# EAGLE design SNES2USB (EAGLE 9.5.2)
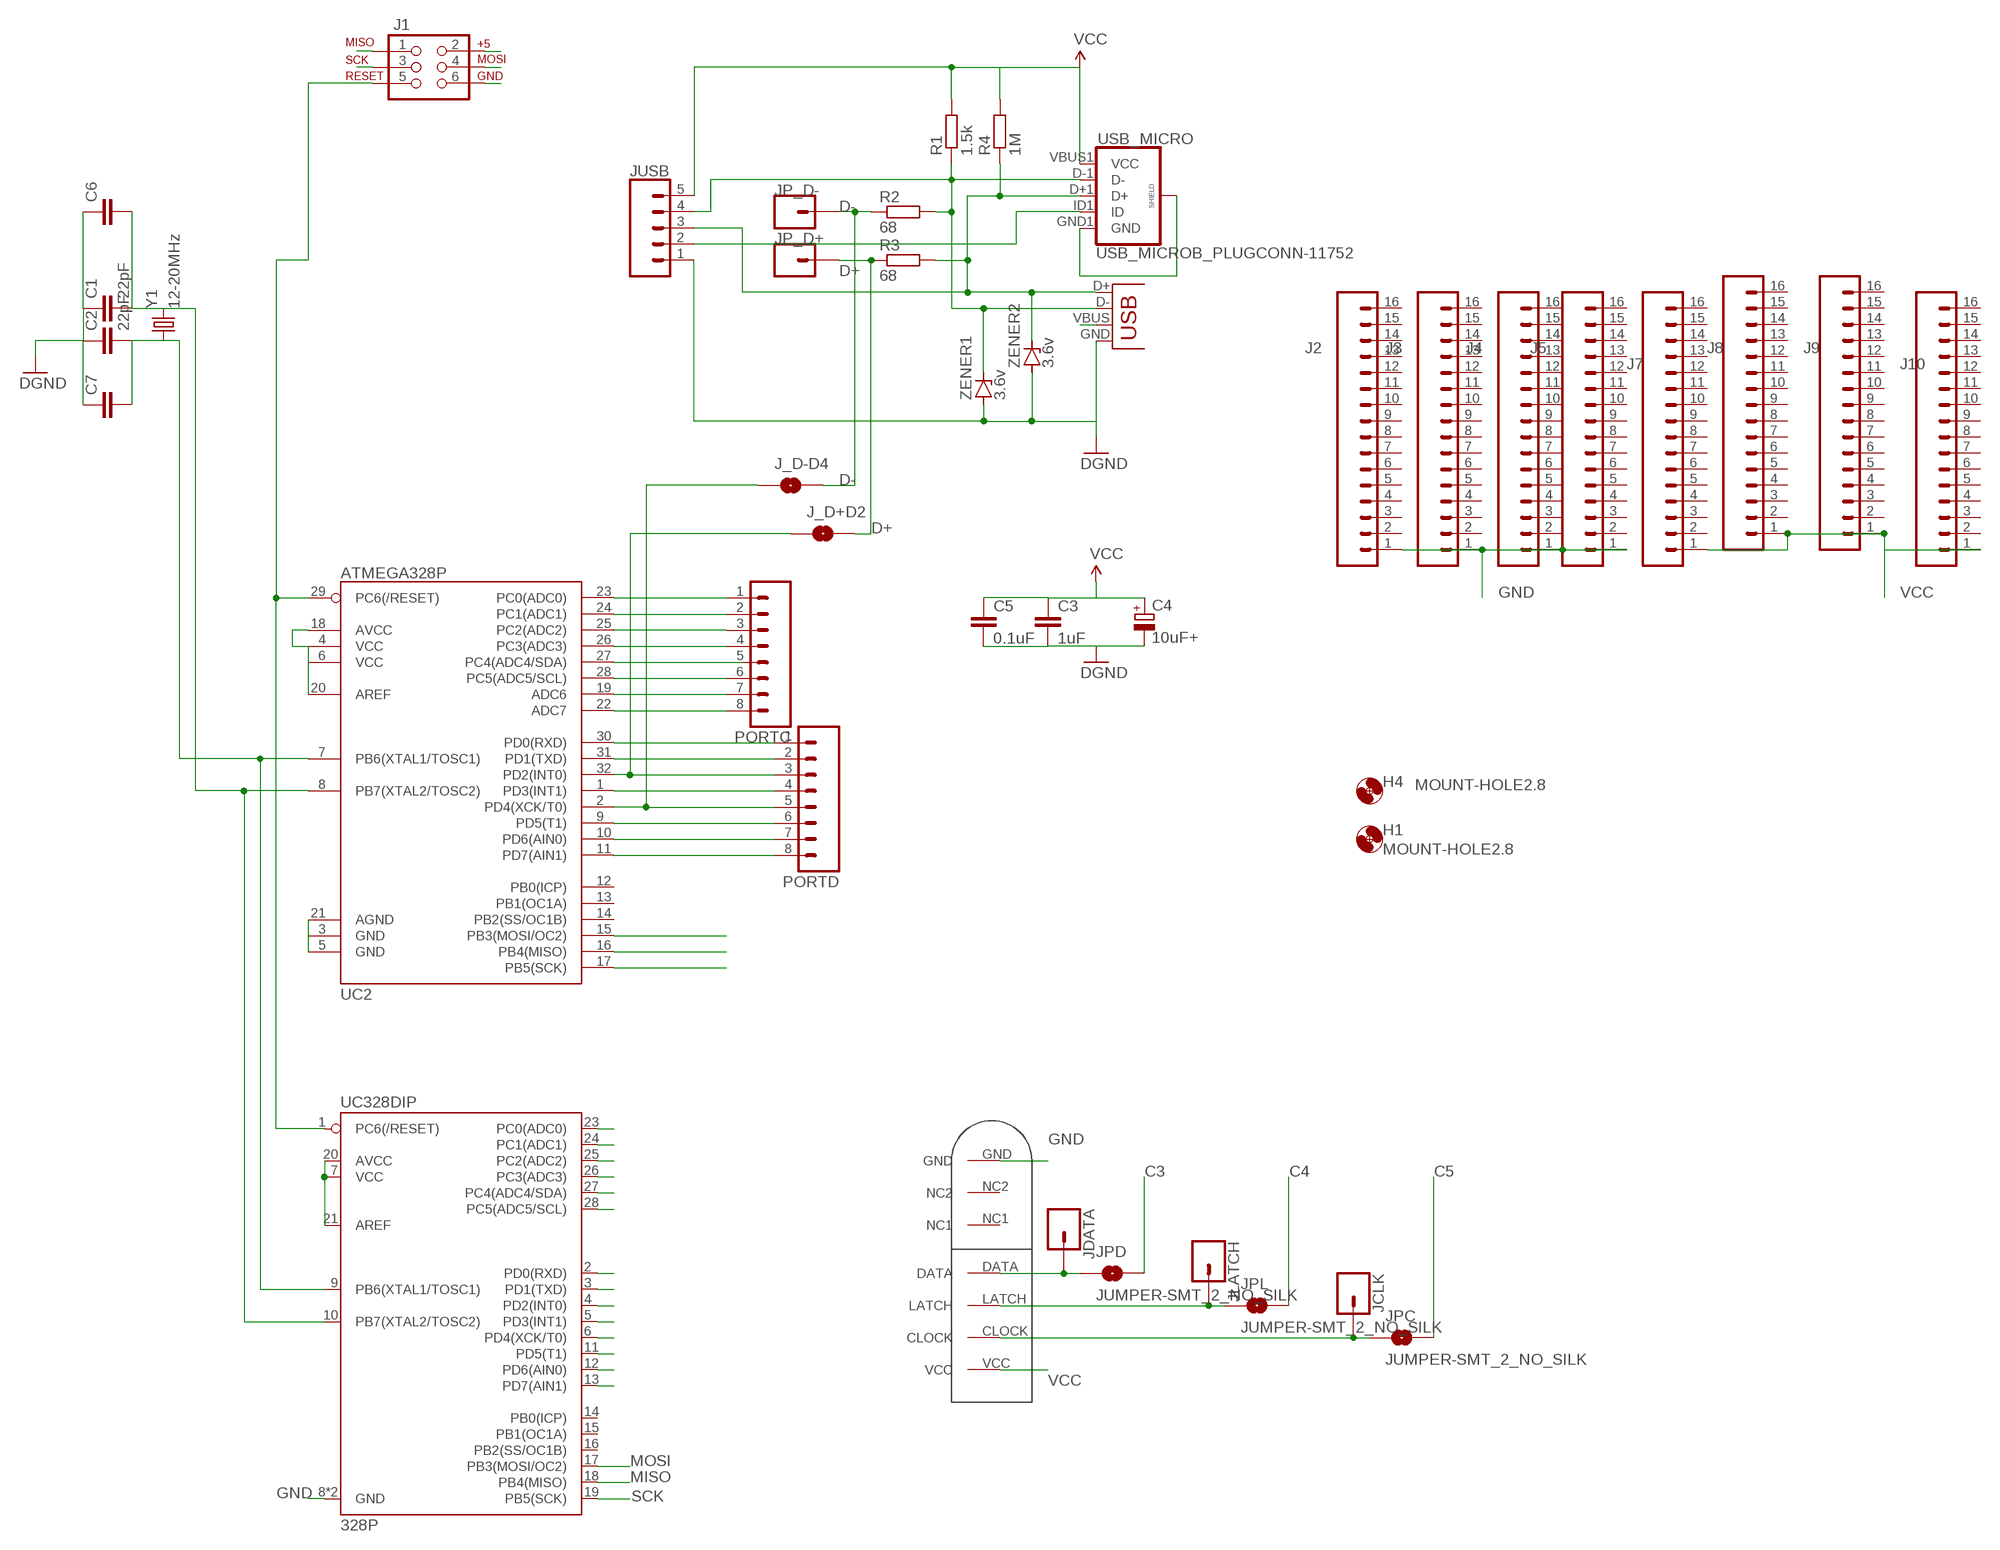
[diagram p0: schematic, sheet 1]

## Parts
C1  22pF  C-EU025-024X044  [C025-024X044]
C2  22pF  C-EU025-024X044  [C025-024X044]
C3  1uF  C-EU025-024X044  [C025-024X044]
C4  10uF+  CPOL-EUE2-5  [E2-5]
C5  0.1uF  C-EU025-024X044  [C025-024X044]
C6  C-EUC1206K  [C1206K]
C7  C-EUC1206K  [C1206K]
H1  MOUNT-HOLE2.8  [2,8]
H4  MOUNT-HOLE2.8  [2,8]
J1  AVR_SPI_PRG_6PTH  [2X3]
J2  CONN_161X16_NO_SILK  [1X16_NO_SILK]
J3  CONN_161X16_NO_SILK  [1X16_NO_SILK]
J4  CONN_161X16_NO_SILK  [1X16_NO_SILK]
J5  CONN_161X16_NO_SILK  [1X16_NO_SILK]
J7  CONN_161X16_NO_SILK  [1X16_NO_SILK]
J8  CONN_161X16_NO_SILK  [1X16_NO_SILK]
J9  CONN_161X16_NO_SILK  [1X16_NO_SILK]
J10  CONN_161X16_NO_SILK  [1X16_NO_SILK]
J_D+D2  JUMPER-PAD-2-NOYES_SILK  [PAD-JUMPER-2-NO_YES_SILK]
J_D-D4  JUMPER-PAD-2-NOYES_SILK  [PAD-JUMPER-2-NO_YES_SILK]
JCLK  CONN_01PTH_NO_SILK_YES_STOP  [1X01_NO_SILK]
JDATA  CONN_01PTH_NO_SILK_YES_STOP  [1X01_NO_SILK]
JLATCH  CONN_01PTH_NO_SILK_YES_STOP  [1X01_NO_SILK]
JP_D+  CONN_01PTH_NO_SILK_YES_STOP  [1X01_NO_SILK]
JP_D-  CONN_01PTH_NO_SILK_YES_STOP  [1X01_NO_SILK]
JPC  JUMPER-SMT_2_NO_SILK  [SMT-JUMPER_2_NO_SILK]
JPD  JUMPER-SMT_2_NO_SILK  [SMT-JUMPER_2_NO_SILK]
JPL  JUMPER-SMT_2_NO_SILK  [SMT-JUMPER_2_NO_SILK]
JUSB  CONN_05  [1X05]
PORTC  M081X08  [1X08]
PORTD  M081X08  [1X08]
R1  1.5k  R-EU_0204/2V  [0204V]
R2  68  R-EU_0204/2V  [0204V]
R3  68  R-EU_0204/2V  [0204V]
R4  1M  R-EU_0204/2V  [0204V]
U$1  SNES_JOYPAD_CONNECTOR  [SNES_PAD]
UC2  ATMEGA328P  ATMEGA328_SMT  [TQFP32-08]
UC328DIP  328P  ATMEGA328P_PDIP  [DIP28]
USB_MICRO  USB_MICROB_PLUGCONN-11752  [USB-B-MICRO-SMD_V03]
USB_MINI  USBSMD  [USB-MINIB]
Y1  12-20MHz  CRYSTALHC49UV  [HC49U-V]
ZENER1  3.6v  ZENER-DIODEZD-2.5  [ZDIO-2.5]
ZENER2  3.6v  ZENER-DIODEZD-2.5  [ZDIO-2.5]

## Nets
B6: C2.2 C7.2 UC2.7(PB6(XTAL1/TOSC1)) UC328DIP.9(PB6(XTAL1/TOSC1)) Y1.1
B7: C1.2 C6.2 UC2.8(PB7(XTAL2/TOSC2)) UC328DIP.10(PB7(XTAL2/TOSC2)) Y1.2
C0: PORTC.1 UC2.23(PC0(ADC0)) UC328DIP.23(PC0(ADC0))
C1: PORTC.2 UC2.24(PC1(ADC1)) UC328DIP.24(PC1(ADC1))
C2: UC328DIP.25(PC2(ADC2))
C3: JPD.2 PORTC.4 UC2.26(PC3(ADC3)) UC328DIP.26(PC3(ADC3))
C4: JPL.2 PORTC.5 UC2.27(PC4(ADC4/SDA)) UC328DIP.27(PC4(ADC4/SDA))
C5: JPC.2 PORTC.6 UC2.28(PC5(ADC5/SCL)) UC328DIP.28(PC5(ADC5/SCL))
D0: PORTD.1 UC2.30(PD0(RXD)) UC328DIP.2(PD0(RXD))
D1: PORTD.2 UC2.31(PD1(TXD)) UC328DIP.3(PD1(TXD))
D2: J_D+D2.1 PORTD.3 UC2.32(PD2(INT0)) UC328DIP.4(PD2(INT0))
D3: PORTD.4 UC2.1(PD3(INT1)) UC328DIP.5(PD3(INT1))
D4: J_D-D4.1 PORTD.5 UC2.2(PD4(XCK/T0)) UC328DIP.6(PD4(XCK/T0))
D5: PORTD.6 UC2.9(PD5(T1)) UC328DIP.11(PD5(T1))
D6: PORTD.7 UC2.10(PD6(AIN0)) UC328DIP.12(PD6(AIN0))
D7: PORTD.8 UC2.11(PD7(AIN1)) UC328DIP.13(PD7(AIN1))
D+: J_D+D2.2 JP_D+.1 R3.1
D-: J_D-D4.2 JP_D-.1 R2.1
GND: C1.1 C2.1 C3.2 C4.- C5.2 C6.1 C7.1 J1.6 J2.1 J3.1 J4.1 J5.1 JUSB.1 U$1.GND UC2.3(GND) UC2.5(GND) UC2.21(AGND) UC328DIP.8(GND) UC328DIP.22(GND) USB_MICRO.GND1(GND) USB_MICRO.SHIELD1(SHIELD) USB_MICRO.SHIELD2(SHIELD) USB_MICRO.SHIELD3(SHIELD) USB_MINI.GND ZENER1.A ZENER2.A ; supply symbol labelled DGND
MISO: J1.1 UC2.16(PB4(MISO)) UC328DIP.18(PB4(MISO))
MOSI: J1.4 UC2.15(PB3(MOSI/OC2)) UC328DIP.17(PB3(MOSI/OC2))
N$1: JUSB.2 USB_MICRO.ID1(ID)
N$2: JDATA.1 JPD.1 U$1.DATA
N$3: PORTC.3 UC2.25(PC2(ADC2))
N$4: JLATCH.1 JPL.1 U$1.LATCH
N$5: JCLK.1 JPC.1 U$1.CLOCK
N$11: PORTC.7 UC2.19(ADC6)
N$12: PORTC.8 UC2.22(ADC7)
RESET: J1.5 UC2.29(PC6(/RESET)) UC328DIP.1(PC6(/RESET))
SCK: J1.3 UC2.17(PB5(SCK)) UC328DIP.19(PB5(SCK))
USBD+: JUSB.3 R3.2 R4.1 USB_MICRO.D+1(D+) USB_MINI.D+ ZENER2.C
USBD-: JUSB.4 R1.1 R2.2 USB_MICRO.D-1(D-) USB_MINI.D- ZENER1.C
VCC: C3.1 C4.+ C5.1 J1.2 J7.1 J8.1 J9.1 J10.1 JUSB.5 R1.2 R4.2 U$1.VCC UC2.4(VCC) UC2.6(VCC) UC2.18(AVCC) UC2.20(AREF) UC328DIP.7(VCC) UC328DIP.20(AVCC) UC328DIP.21(AREF) USB_MICRO.VBUS1(VCC) USB_MINI.VBUS
Unconnected: J2.2 J2.3 J2.4 J2.5 J2.6 J2.7 J2.8 J2.9 J2.10 J2.11 J2.12 J2.13 J2.14 J2.15 J2.16 J3.2 J3.3 J3.4 J3.5 J3.6 J3.7 J3.8 J3.9 J3.10 J3.11 J3.12 J3.13 J3.14 J3.15 J3.16 J4.2 J4.3 J4.4 J4.5 J4.6 J4.7 J4.8 J4.9 J4.10 J4.11 J4.12 J4.13 J4.14 J4.15 J4.16 J5.2 J5.3 J5.4 J5.5 J5.6 J5.7 J5.8 J5.9 J5.10 J5.11 J5.12 J5.13 J5.14 J5.15 J5.16 J7.2 J7.3 J7.4 J7.5 J7.6 J7.7 J7.8 J7.9 J7.10 J7.11 J7.12 J7.13 J7.14 J7.15 J7.16 J8.2 J8.3 J8.4 J8.5 J8.6 J8.7 J8.8 J8.9 J8.10 J8.11 J8.12 J8.13 J8.14 J8.15 J8.16 J9.2 J9.3 J9.4 J9.5 J9.6 J9.7 J9.8 J9.9 J9.10 J9.11 J9.12 J9.13 J9.14 J9.15 J9.16 J10.2 J10.3 J10.4 J10.5 J10.6 J10.7 J10.8 J10.9 J10.10 J10.11 J10.12 J10.13 J10.14 J10.15 J10.16 U$1.NC1 U$1.NC2 UC2.12(PB0(ICP)) UC2.13(PB1(OC1A)) UC2.14(PB2(SS/OC1B)) UC328DIP.14(PB0(ICP)) UC328DIP.15(PB1(OC1A)) UC328DIP.16(PB2(SS/OC1B))

## Library data of the parts
C1-C3 C5-C7 = resistor:C-EU: CAPACITOR, European symbol
C4 = resistor:CPOL-EU: POLARIZED CAPACITOR, European symbol
H1 H4 = holes:MOUNT-HOLE: MOUNTING HOLE with drill center marker
J1 = SparkFun-Connectors:AVR_SPI_PRG_6: AVR ISP 6 Pin This is the reduced ISP connector for AVR programming. Common on Arduino. This footprint will take up less PCB space and can be used with a 10-pin to 6-pin adapter such as SKU: BOB-08508 **Special note about "TEST_POINT" package. The stop mask is on the top side, so if you want your programming test points to be on the bottom of your board, make sure to place this package on the bottom side of the board. This also ensure that the orientation to program from the bottom side will be correct.
J2-J5 J7-J10 = SparkFun-Connectors:CONN_16: Multi connection point. Often used as Generic Header-pin footprint for 0.1 inch spaced/style header connections On any of the 0.1 inch spaced packages, you can populate with these: Break Away Headers - Straight <https://www.sparkfun.com/products/116> (PRT-00116) Break Away Male Headers - Right Angle <https://www.sparkfun.com/products/553> (PRT-00553) Female Headers <https://www.sparkfun.com/products/115> (PRT-00115) Break Away Headers - Machine Pin <https://www.sparkfun.com/products/117> (PRT-00117) Break Away Female Headers - Swiss Machine Pin <https://www.sparkfun.com/products/743> (PRT-00743) For SCREWTERMINALS and SPRING TERMINALS visit here: Screw Terimnals on SparkFun.com <https://www.sparkfun.com/search/results?term=Screw+Terminals> (5mm/3.5mm/2.54mm spacing) This device is also useful as a general connection point to wire up your design to another part of your project. Our various solder wires solder well into these plated through hole pads. Hook-Up Wire - Assortment (Stranded, 22 AWG) <https://www.sparkfun.com/products/11375> (PRT-11375) Hook-Up Wire - Assortment (Solid Core, 22 AWG) <https://www.sparkfun.com/products/11367> (PRT-11367) View the entire wire category on our website here <https://www.sparkfun.com/categories/141> Special notes: Molex polarized connector foot print use with SKU : PRT-08231 with associated crimp pins and housings. 1MM SMD Version SKU: PRT-10208 NOTES ON THE VARIANTS LOCK and LOCK_LONGPADS... This footprint was designed to help hold the alignment of a through-hole component (i.e. 6-pin header) while soldering it into place. You may notice that each hole has been shifted either up or down by 0.005 of an inch from it's more standard position (which is a perfectly straight line). This slight alteration caused the pins (the squares in the middle) to touch the edges of the holes. Because they are alternating, it causes a "brace" to hold the component in place. 0.005 has proven to be the perfect amount of "off-center" position when using our standard breakaway headers. Although looks a little odd when you look at the bare footprint, once you have a header in there, the alteration is very hard to notice. Also,if you push a header all the way into place, it is covered up entirely on the bottom side.
J_D+D2 J_D-D4 = SparkFun-Passives:JUMPER-PAD-2-NO
JCLK JDATA JLATCH JP_D+ JP_D- = SparkFun-Connectors:CONN_01: Single connection point. Often used as Generic Header-pin footprint for 0.1 inch spaced/style header connections On any of the 0.1 inch spaced packages, you can populate with these: Break Away Headers - Straight <https://www.sparkfun.com/products/116> (PRT-00116) Break Away Male Headers - Right Angle <https://www.sparkfun.com/products/553> (PRT-00553) Female Headers <https://www.sparkfun.com/products/115> (PRT-00115) Break Away Headers - Machine Pin <https://www.sparkfun.com/products/117> (PRT-00117) Break Away Female Headers - Swiss Machine Pin <https://www.sparkfun.com/products/743> (PRT-00743) This device is also useful as a general connection point to wire up your design to another part of your project. Our various solder wires solder well into these plated through hole pads. Hook-Up Wire - Assortment (Stranded, 22 AWG) <https://www.sparkfun.com/products/11375> (PRT-11375) Hook-Up Wire - Assortment (Solid Core, 22 AWG) <https://www.sparkfun.com/products/11367> (PRT-11367) View the entire wire category on our website here <https://www.sparkfun.com/categories/141> Special notes: SMTSO-256-ET is a "flush mount" nut for a 4-40 screw. We mostly use this on specialty testbeds; it is a nice way to connect hardware to your PCB at an adjustable hieght. Also note, the SNAP packages are for using a snappable style connector. We sell a baggie of snaps and they are also used on two LilyPad designs: Snap Assortment - 30 pack (male and female) <https://www.sparkfun.com/products/11347> (DEV-11347) LilyPad Arduino SimpleSnap <https://www.sparkfun.com/products/10941> (DEV-10941) LilyPad SimpleSnap Protoboard <https://www.sparkfun.com/products/10940> (DEV-10940)
JPC JPD JPL = SparkFun-Jumpers:JUMPER-SMT_2_NO: Normally open jumper This jumper has two pads in close proximity to each other. Apply solder to close the connection. Round pads are easier to solder for beginners, but are a lot larger. SparkFun Product that uses the round pads: SparkFun EL Sequencer <https://www.sparkfun.com/products/12781>
JUSB = SparkFun-Connectors:CONN_05: Multi connection point. Often used as Generic Header-pin footprint for 0.1 inch spaced/style header connections On any of the 0.1 inch spaced packages, you can populate with these: Break Away Headers - Straight <https://www.sparkfun.com/products/116> (PRT-00116) Break Away Male Headers - Right Angle <https://www.sparkfun.com/products/553> (PRT-00553) Female Headers <https://www.sparkfun.com/products/115> (PRT-00115) Break Away Headers - Machine Pin <https://www.sparkfun.com/products/117> (PRT-00117) Break Away Female Headers - Swiss Machine Pin <https://www.sparkfun.com/products/743> (PRT-00743) For SCREWTERMINALS and SPRING TERMINALS visit here: Screw Terimnals on SparkFun.com <https://www.sparkfun.com/search/results?term=Screw+Terminals> (5mm/3.5mm/2.54mm spacing) This device is also useful as a general connection point to wire up your design to another part of your project. Our various solder wires solder well into these plated through hole pads. Hook-Up Wire - Assortment (Stranded, 22 AWG) <https://www.sparkfun.com/products/11375> (PRT-11375) Hook-Up Wire - Assortment (Solid Core, 22 AWG) <https://www.sparkfun.com/products/11367> (PRT-11367) View the entire wire category on our website here <https://www.sparkfun.com/categories/141> Special notes: Molex polarized connector foot print use with SKU : PRT-08231 with associated crimp pins and housings. 1MM SMD Version SKU: PRT-10208
PORTC PORTD = SparkFun-Connectors:M08: Header 8 Standard 8-pin 0.1" header. Use with straight break away headers (SKU : PRT-00116), right angle break away headers (PRT-00553), swiss pins (PRT-00743), machine pins (PRT-00117), and female headers (PRT-00115).
R1-R4 = resistor:R-EU_: RESISTOR, European symbol
U$1 = kalshagar:SNES_JOYPAD_CONNECTOR: Super NES joypad connector.
UC2 = SparkFun-DigitalIC:ATMEGA328_SMT: 32-Pin Atmega328 part Commonly used on Arduino compatible boards Available in QFP and QFN packages TQFP is IC-09069 QFN is non-stock; PROD_ID: IC-09069
UC328DIP = SparkFun-IC-Microcontroller:ATMEGA328P_PDIP: Atmel 328P Through hole ATMEGA328P uC used in the Arduino 32kb flash, 1k EEPROM, 2k SRAM Datasheet <http://www.sparkfun.com/datasheets/Components/SMD/ATMega328.pdf> SparkFun Products Storefront component: AVR 28 Pin 20MHz 32K 6A/D - ATMega328P <https://www.sparkfun.com/products/9061> (COM-09061) SparkFun Simon Says - Through-Hole Soldering Kit <https://www.sparkfun.com/products/10547> (KIT-10547) SparkFun Learn to Solder - Simon Says <https://www.sparkfun.com/products/13708> (KIT-13708) SparkFun BigTime Watch Kit <https://www.sparkfun.com/products/11734> (KIT-11734) SparkFun ClockIt <https://www.sparkfun.com/products/10930> (KIT-10930) SparkFun Serial Enabled LCD Kit <https://www.sparkfun.com/products/10097> (LCD-10097) SparkFun Simon Tilts - Through Hole Soldering Kit <https://www.sparkfun.com/products/12634> (KIT-12634) SparkFun Frequency Counter Kit <https://www.sparkfun.com/products/10140> (KIT-10140) FabFM Radio Kit <https://www.sparkfun.com/products/11043> (KIT-11043) SparkFun Binary Blaster Kit <https://www.sparkfun.com/products/12037> (KIT-12037) SparkFun Metro-Gnome <https://www.sparkfun.com/products/9236> (KIT-09236) ATmega328 with Arduino Optiboot (Uno) <https://www.sparkfun.com/products/10524> (DEV-10524); PROD_ID: IC-09136
USB_MICRO = SparkFun-Connectors:USB_MICROB_PLUG: USB Micro-B connectors Some male, some female. Watch your step!; PROD_ID: CONN-11752
USB_MINI = SparkFun-Connectors:USB: USB Connectors USB-B-PTH is fully proven SKU : PRT-00139/CONN-08278 USB-miniB is fully proven SKU : PRT-00587 USB-A-PCB is untested. USB-A-H is throughly reviewed, but untested. Spark Fun Electronics SKU : PRT-00437 USB-B-SMT is throughly reviewed, but untested. Needs silkscreen touching up. USB-A-S has not been used/tested USB-MB-H has not been used/tested USB-MICROB has been used. CONN-09505; PROD_ID: CONN-08193
Y1 = SparkFun-FreqCtrl:CRYSTAL: Various standard crystals. Proven footprints.
ZENER1 ZENER2 = diode:ZENER-DIODE: Z-Diode

## Board
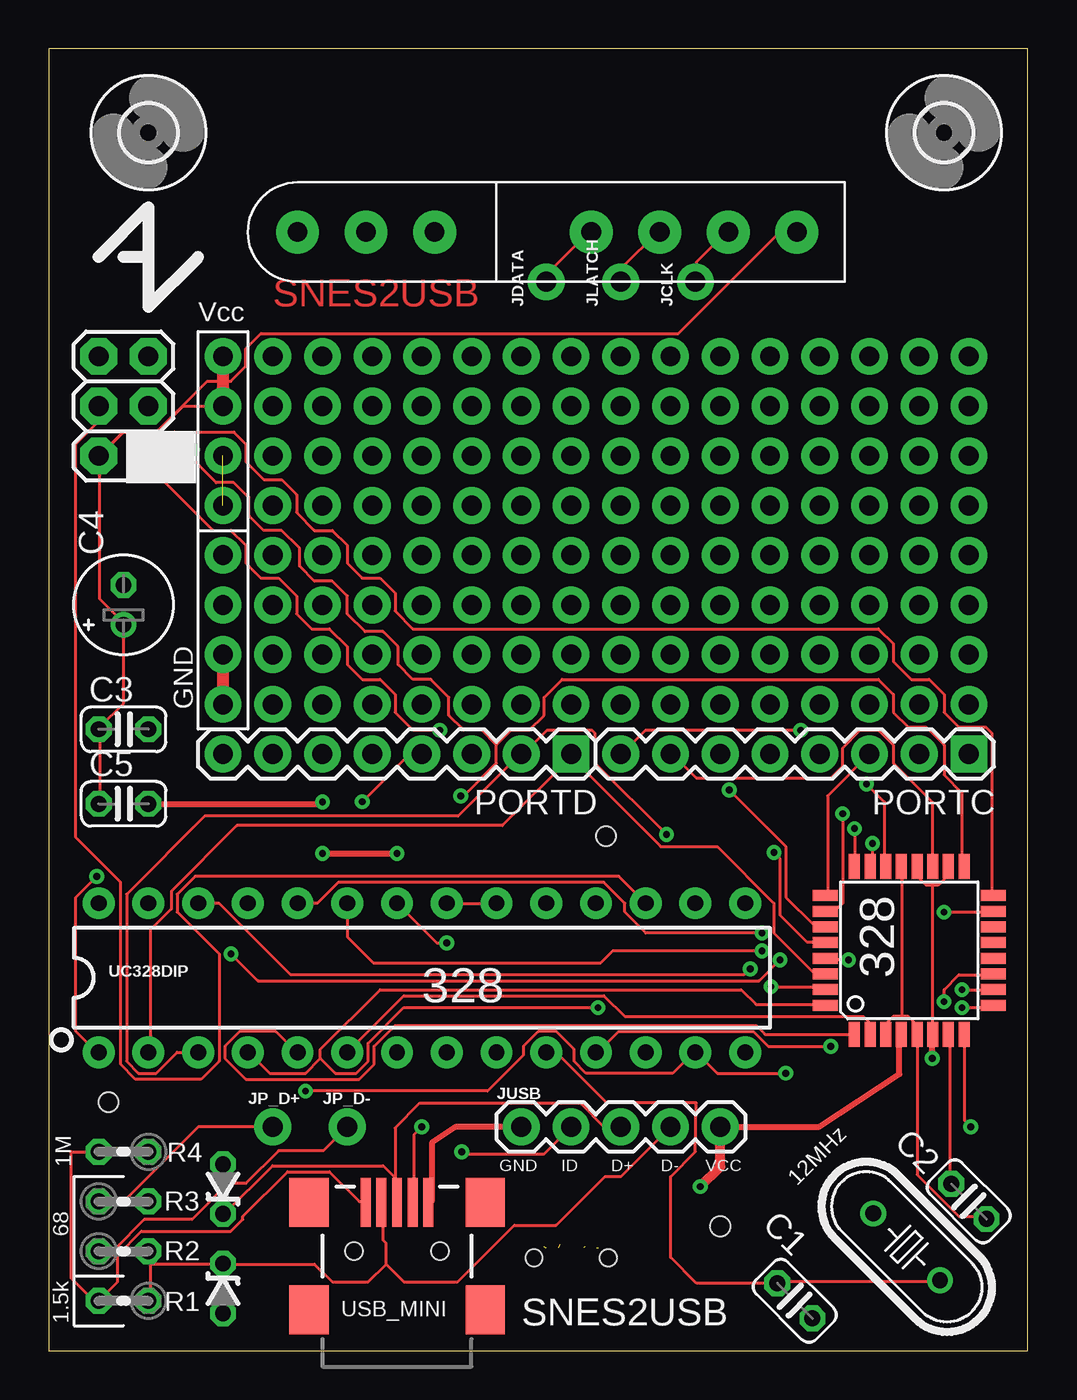
[diagram p1: board, top side]
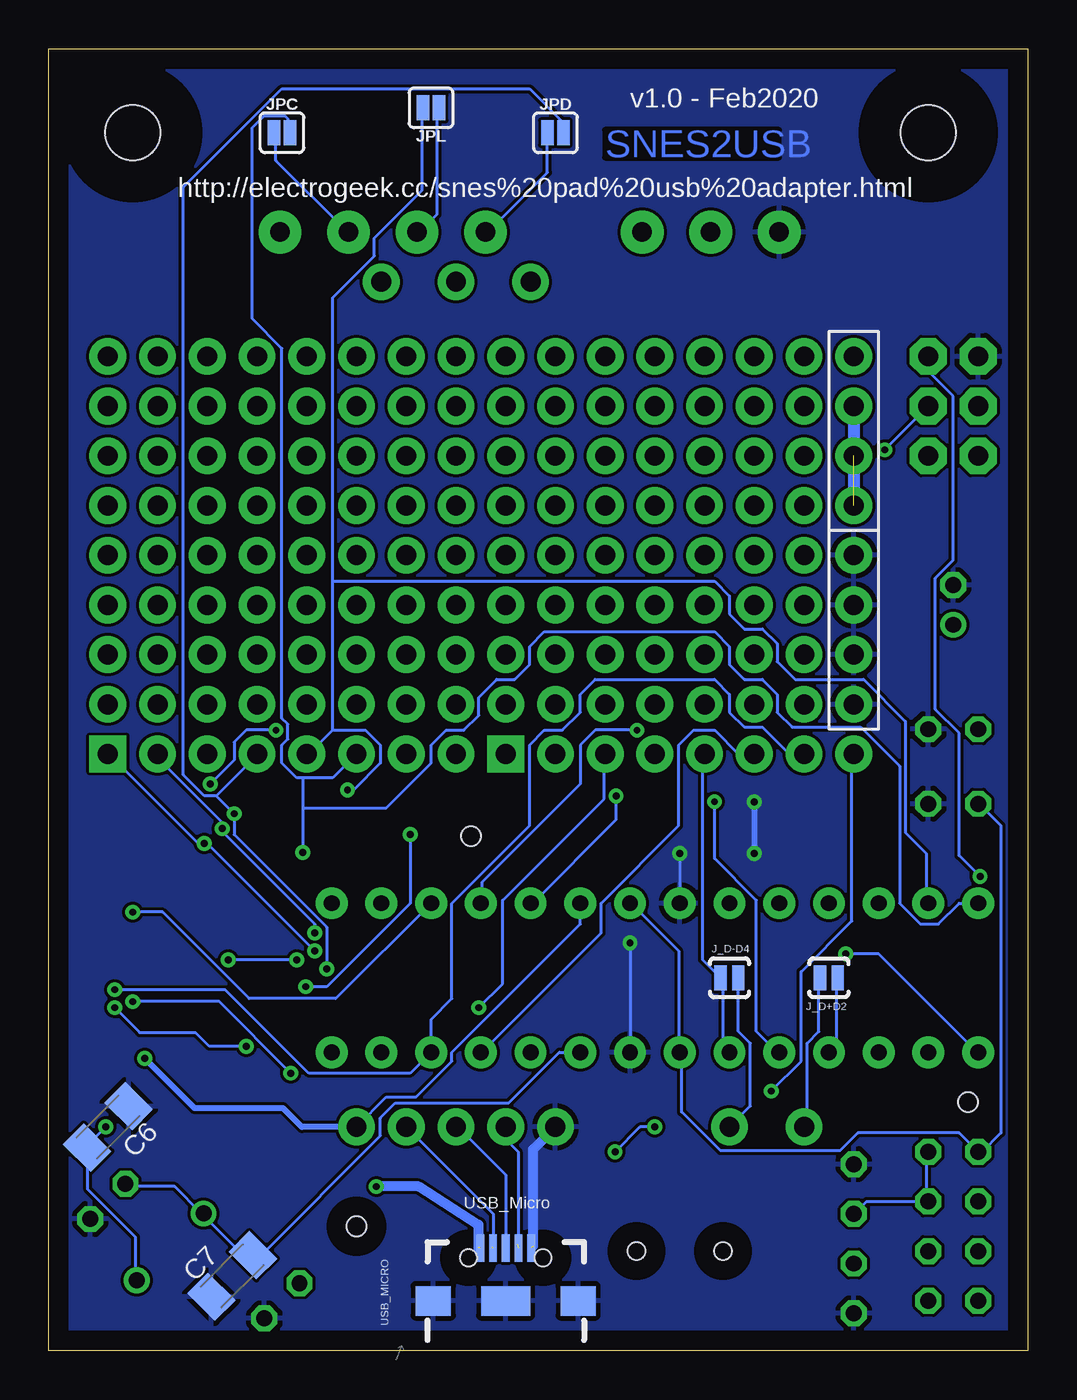
[diagram p2: board, bottom side, seen from below]

Size 50 x 66.51 mm. Coordinates in mm from the lower left corner, seen from the top.
Outline: 0,0 50,0 50,66.51 0,66.51 0,0
Copper layers (1*16): Top 0.035mm / dielectric 1.5mm / Bottom 0.035mm
Design rules "default": minimum track width 6mil, minimum drill 0.35mm, track to track 6mil, track to pad 6mil, pad to pad 6mil, via to via 6mil, smd to smd 6mil, copper to edge 40mil, drill to drill 6mil, minimum pad ring 10mil, minimum via ring 8mil, stop-mask expansion 4mil, vias tented up to drill 0mil, thermal gap 10mil
Holes 1 mm at 34.29,6.35 28.45,26.29 3.05,12.7

### Footprints (pad centres in the part's own frame; a part is rotated, then mirrored left to right if it is on the bottom)
C025-024X044 = drill 0.813 octagon: 1 -1.27,0; 2 1.27,0
E2-5 = drill 0.813 pad 1.27: + -1.016,0 | drill 0.813 pad 1.27 octagon: - 1.016,0
C1206K = smd 1.5 x 2: 1 -1.5,0; 2 1.5,0
2,8 = hole 2.8: 0,0
2X3 = drill 1.016 pad 1.88 octagon: 1 0,0; 2 0,2.54; 3 2.54,0; 4 2.54,2.54; 5 5.08,0; 6 5.08,2.54
1X16_NO_SILK = drill 1.016 pad 1.88: 1 0,0; 2 2.54,0; 3 5.08,0; 4 7.62,0; 5 10.16,0; 6 12.7,0; 7 15.24,0; 8 17.78,0; 9 20.32,0; 10 22.86,0; 11 25.4,0; 12 27.94,0; 13 30.48,0; 14 33.02,0; 15 35.56,0; 16 38.1,0
PAD-JUMPER-2-NO_YES_SILK = smd 0.635 x 1.27: 1 -0.45,0; 2 0.45,0
1X01_NO_SILK = drill 1.016 pad 1.88: 1 0,0
SMT-JUMPER_2_NO_SILK = smd 0.635 x 1.27: 1 -0.406,0; 2 0.406,0
1X05 = drill 1.016 pad 1.88: 1 0,0; 2 2.54,0; 3 5.08,0; 4 7.62,0; 5 10.16,0
1X08 = drill 1.016 pad 1.88 square: 1 0,0 | drill 1.016 pad 1.88: 2 2.54,0; 3 5.08,0; 4 7.62,0; 5 10.16,0; 6 12.7,0; 7 15.24,0; 8 17.78,0
0204V = drill 0.813 octagon: 1 -1.27,0; 2 1.27,0
SNES_PAD = drill 1 pad 2.184: CLOCK 22,0; DATA 15,0; GND 0,0; LATCH 18.5,0; NC1 7,0; NC2 3.5,0; VCC 25.5,0
TQFP32-08 = smd 1.27 x 0.559: 1 -4.293,2.8; 2 -4.293,2; 3 -4.293,1.2; 4 -4.293,0.4; 5 -4.293,-0.4; 6 -4.293,-1.2; 7 -4.293,-2; 8 -4.293,-2.8; 17 4.293,-2.8; 18 4.293,-2; 19 4.293,-1.2; 20 4.293,-0.4; 21 4.293,0.4; 22 4.293,1.2; 23 4.293,2; 24 4.293,2.8 | smd 0.559 x 1.27: 9 -2.8,-4.293; 10 -2,-4.293; 11 -1.2,-4.293; 12 -0.4,-4.293; 13 0.4,-4.293; 14 1.2,-4.293; 15 2,-4.293; 16 2.8,-4.293; 25 2.8,4.293; 26 2,4.293; 27 1.2,4.293; 28 0.4,4.293; 29 -0.4,4.293; 30 -1.2,4.293; 31 -2,4.293; 32 -2.8,4.293
DIP28 = drill 0.813 pad 1.626: 1 -16.51,-3.81; 2 -13.97,-3.81; 3 -11.43,-3.81; 4 -8.89,-3.81; 5 -6.35,-3.81; 6 -3.81,-3.81; 7 -1.27,-3.81; 8 1.27,-3.81; 9 3.81,-3.81; 10 6.35,-3.81; 11 8.89,-3.81; 12 11.43,-3.81; 13 13.97,-3.81; 14 16.51,-3.81; 15 16.51,3.81; 16 13.97,3.81; 17 11.43,3.81; 18 8.89,3.81; 19 6.35,3.81; 20 3.81,3.81; 21 1.27,3.81; 22 -1.27,3.81; 23 -3.81,3.81; 24 -6.35,3.81; 25 -8.89,3.81; 26 -11.43,3.81; 27 -13.97,3.81; 28 -16.51,3.81
USB-B-MICRO-SMD_V03 = smd 1.4 x 0.4: D+1 2.7,0; D-1 2.7,0.65; GND1 2.7,-1.3; ID1 2.7,-0.65; VBUS1 2.7,1.3 | smd 1.5 x 1.8: SHIELD1 0,3.7; SHIELD2 0,-3.7 | smd 1.5 x 2.5: SHIELD3 0,0 | hole 0.85: 2.2,1.9; 2.2,-1.9
USB-MINIB = smd 2.5 x 0.5: D+ 2.5,0; D- 2.5,0.8; GND 2.5,-1.6; ID 2.5,-0.8; VBUS 2.5,1.6 | smd 2.5 x 2: MTN1 -3,4.5; MTN2 2.5,4.5; MTN3 -3,-4.5; MTN4 2.5,-4.5 | hole 0.9: 0,2.2; 0,-2.2
HC49U-V = drill 0.813: 1 -2.413,0; 2 2.413,0
ZDIO-2.5 = drill 0.813 octagon: A 1.27,0; C -1.27,0

### Placement (x,y rotation side)
C1  38.1,2.54 135 top
C2  46.99,7.62 135 top
C3  3.81,31.75 0 top
C4  3.81,38.1 90 top
C5  3.81,27.94 0 top
C6  46.99,11.43 225 bottom
C7  40.64,3.81 45 bottom
H1  5.08,62.23 0 top
H4  45.72,62.23 0 top
J1  5.08,45.72 90 top
J2  8.89,40.64 0 top
J3  8.89,33.02 0 top
J4  8.89,35.56 0 top
J5  8.89,38.1 0 top
J7  8.89,43.18 0 top
J8  8.89,45.72 0 top
J9  8.89,48.26 0 top
J10  8.89,50.8 0 top
J_D+D2  10.16,19.05 180 bottom
J_D-D4  15.24,19.05 0 bottom
JCLK  33.02,54.61 90 top
JDATA  25.4,54.61 90 top
JLATCH  29.21,54.61 90 top
JP_D+  11.43,11.43 0 top
JP_D-  15.24,11.43 0 top
JPC  38.1,62.23 0 bottom
JPD  24.13,62.23 0 bottom
JPL  30.48,63.5 180 bottom
JUSB  24.13,11.43 0 top
PORTC  46.99,30.48 180 top
PORTD  26.67,30.48 180 top
R1  3.81,2.54 180 top
R2  3.81,5.08 0 top
R3  3.81,7.62 0 top
R4  3.81,10.16 180 top
U$1  12.7,57.15 0 top
U$2  [VUSB_LOGO]  48.01,52.83 90 top
UC2  43.94,20.45 90 top
UC328DIP  19.05,19.05 0 top
USB_MICRO  26.67,2.54 90 bottom
USB_MINI  17.78,5.08 90 top
Y1  43.81,5.3 315 top
ZENER1  8.89,3.17 270 top
ZENER2  8.89,8.26 90 top

### Tracks (layer width: path | path; a pad name or v marks a point on that pad's centre or on a via)
B6
  Top 0.152: UC2.7 46.02,16.15 46.02,8.53 C2.2
  Bottom 0.152: UC328DIP.9 23.93,15.24 26.52,12.65 32.31,12.65 33.07,11.89 33.07,10.97 39.17,4.88 39.47,4.88 C7.2 39.62,4.88 40.08,4.88 42.06,6.86 Y1.1 42.22,7.01 43.59,8.38 46.02,8.38 C2.2
B7  (via drill 0.35)
  Top 0.152: v47.09,11.43 46.79,11.73 46.79,16.15 UC2.8 | Y1.2 45.41,3.5 37.34,3.5 C1.2 33.07,3.44 31.75,4.76 31.75,8.89 33.02,10.16 33.07,12.65 28.5,12.65 25.91,15.24 UC328DIP.10
  Bottom 0.152: v47.09,11.43 48.01,10.52 C6.2 48.01,10.36 48.01,8.23 45.57,5.79 45.57,3.66 Y1.2
C0  (via drill 0.35)
  Top 0.152: v42.06,25.91 42.06,24.84 UC2.23 | UC328DIP.23 15.24,21.13 16.59,19.79 28.17,19.79 28.8,20.42 v36.42,20.42
  Bottom 0.152: PORTC.1 46.94,30.48 42.37,25.91 v42.06,25.91 41.91,25.91 v36.42,20.42
C1  (via drill 0.35)
  Top 0.152: v41.15,26.67 41.15,24.84 UC2.24 | UC328DIP.24 13.72,22.86 14.78,23.93 28.35,23.93 29.41,22.86 29.41,22.4 30.48,21.34 v36.42,21.34
  Bottom 0.152: PORTC.2 44.35,30.48 44.35,30.18 41.15,26.98 v41.15,26.67 41.15,26.52 36.42,21.79 v36.42,21.34
C3  (via drill 0.35)
  Top 0.152: v40.54,27.43 40.54,22.86 40.23,22.55 39.78,22.55 UC2.26 | UC328DIP.26 8.69,22.86 12.34,19.2 35.51,19.2 v35.81,19.51
  Bottom 0.152: 41.45,28.35 42.06,28.35 43.13,29.41 43.13,59.44 38.1,64.47 25.45,64.47 23.77,62.79 23.77,62.33 JPD.2 | 41.45,28.35 39.32,30.48 PORTC.4 | 41.45,28.35 v40.54,27.43 40.54,26.36 35.81,21.64 v35.81,19.51
C4  (via drill 0.35)
  Top 0.152: v34.75,28.65 37.64,25.76 37.64,23.16 39.01,21.79 39.62,21.79 UC2.27
  Bottom 0.152: v34.75,28.65 34.44,28.65 33.07,30.02 33.07,30.94 33.83,31.7 35.51,31.7 | 35.51,31.7 36.73,30.48 PORTC.5 | 35.51,31.7 35.51,39.32 | 35.51,39.32 35.51,53.8 33.38,55.93 33.38,56.84 30.94,59.28 30.94,63.4 JPL.2 | 35.51,39.32 16,39.32 15.24,38.56 15.24,37.64 14.48,36.88 13.56,36.88 12.8,36.12 12.8,35.2 11.89,34.29 8.38,34.29 6.25,32.16 6.25,26.47 5.18,25.4 5.18,22.86 UC328DIP.27
C5  (via drill 0.35)
  Top 0.152: v37.03,25.45 37.34,25.15 37.34,22.25 38.71,20.88 39.62,20.88 UC2.28
  Bottom 0.152: 37.03,29.26 35.51,29.26 PORTC.6 | 37.03,29.26 37.34,29.26 38.1,30.02 38.1,30.94 37.8,31.24 37.8,32 38.1,32.31 38.1,51.21 39.62,52.73 39.62,62.48 39.01,63.09 37.95,63.09 37.8,62.94 37.8,62.33 JPC.2 | 37.03,29.26 37.03,27.74 | 37.03,27.74 v37.03,25.45 | UC328DIP.28 3.5,22.86 4.57,21.79 5.49,21.79 6.55,22.86 6.55,29.87 8.53,31.85 12.04,31.85 12.8,32.61 12.8,33.53 13.56,34.29 14.48,34.29 15.24,35.05 15.24,35.97 16,36.73 24.69,36.73 25.45,35.97 25.45,35.05 26.21,34.29 27.13,34.29 28.04,33.38 28.04,32.46 28.8,31.7 29.72,31.7 30.48,30.94 30.48,30.02 32.77,27.74 37.03,27.74
D0
  Top 0.152: 26.67,30.33 31.24,25.76 34.14,25.76 37.03,22.86 37.03,21.34 39.01,19.36 39.62,19.36 UC2.30 | 26.67,30.33 23.16,26.82 9.6,26.82 6.25,23.47 6.25,22.55 5.18,21.49 5.18,15.24 UC328DIP.2 | 26.67,30.33 PORTD.1
D1  (via drill 0.35)
  Top 0.152: v36.88,18.59 39.62,18.59 UC2.31 | v31.55,26.36 27.89,30.02 27.89,31.55 27.74,31.7 25.45,31.7 24.23,30.48 PORTD.2 24.08,30.48 20.9,27.3 7.95,27.3 3.96,23.32 3.96,14.78 4.57,14.17 5.49,14.17 6.55,15.24 UC328DIP.3
  Bottom 0.152: v36.88,18.59 35.81,18.59 31.55,22.86 v31.55,26.36
D2  (via drill 0.35)
  Top 0.152: 13.87,14.94 13.87,15.39 16.92,18.44 35.36,18.44 36.12,17.68 39.62,17.68 UC2.32 | 13.87,14.94 13.11,14.17 11.28,14.17 10.21,15.24 UC328DIP.4 | v28.04,17.53 18.14,17.53 16.31,15.7 16.31,14.78 15.7,14.17 14.63,14.17 13.87,14.94
  Bottom 0.152: J_D+D2.1 9.75,19.05 9.75,15.54 10.06,15.24 UC328DIP.4 | v28.04,17.53 26.82,18.75 26.82,23.01 21.64,28.19 21.64,30.48 PORTD.3
D3  (via drill 0.35)
  Top 0.152: UC2.1 36.58,16.15 36.12,16.61 17.68,16.61 16.61,15.54 16.61,14.63 15.85,13.87 10.06,13.87 8.99,14.94 8.99,15.54 9.75,16.31 11.58,16.31 12.65,15.24 UC328DIP.5 | PORTD.4 18.44,30.48 v16,28.04
  Bottom 0.152: v16,28.04 16,25.15 13.87,23.01 13.87,16.31 12.8,15.24 UC328DIP.5
D4
  Top 0.152: UC328DIP.6 18.14,18.14 28.35,18.14 29.41,17.07 41.6,17.07 41.91,16.76 41.91,16.15 UC2.2
  Bottom 0.152: UC328DIP.6 15.54,15.54 15.54,19.05 J_D-D4.1 16.61,19.96 16.61,30.48 PORTD.5
D5  (via drill 0.35)
  Top 0.152: v46.63,17.53 48.16,17.53 UC2.9 | v39.93,15.54 36.73,15.54 35.97,16.31 29.11,16.31 28.04,15.24 UC328DIP.11
  Bottom 0.152: v46.63,17.53 45.36,16.26 42.52,16.26 41.81,15.54 v39.93,15.54 | PORTD.6 14.78,30.48 16,31.7 17.07,31.7 17.83,30.94 17.83,26.82 21.79,22.86 21.79,21.34 27.89,15.24 UC328DIP.11
D6  (via drill 0.35)
  Top 0.152: v46.63,18.44 48.16,18.44 UC2.10
  Bottom 0.152: v46.63,18.44 41,18.44 36.73,14.17 31.55,14.17 UC328DIP.12 30.48,16.92 29.41,17.98 29.41,22.86 25.45,26.82 25.45,30.94 24.69,31.7 23.77,31.7 22.86,32.61 22.86,33.53 22.1,34.29 16,34.29 15.24,33.53 15.24,32.61 14.48,31.85 13.56,31.85 12.19,30.48 PORTD.7
D7  (via drill 0.35)
  Top 0.152: v45.72,17.83 45.72,18.44 46.48,19.2 48.16,19.2 UC2.11 | v37.64,14.17 34.14,14.17 33.07,15.24 UC328DIP.13 32.92,15.24 31.85,14.17 27.43,14.17 26.82,14.78 26.82,15.39 25.91,16.31 24.99,16.31 24.23,15.54 24.23,15.09 22.4,13.26 v13.11,13.26
  Bottom 0.152: v45.72,17.83 41.3,17.83 v37.64,14.17 | v13.11,13.26 11.58,14.78 11.58,19.36 8.99,21.95 8.99,30.48 PORTD.8
D+
  Top 0.152: R3.1 3.81,7.62 7.62,11.43 JP_D+.1
  Bottom 0.152: JP_D+.1 11.28,11.58 11.28,15.7 10.67,16.31 10.67,19.05 J_D+D2.2
D-
  Top 0.152: JP_D-.1 14.02,10.21 11.73,10.21 10.06,8.53 9.14,8.53 7.32,6.71 4.88,6.71 3.35,5.18 2.59,5.18 R2.1
  Bottom 0.152: JP_D-.1 14.17,12.5 14.17,15.7 14.78,16.31 J_D-D4.2
GND  (via drill 0.35)  (1 unrouted)
  Top 0.152: 19.51,7.62 USB_MINI.GND | 43.59,17.07 43.89,17.07 44.2,16.76 44.2,16.15 UC2.5 44.35,8.99 46.48,6.86 47.85,6.86 C2.1 | 43.59,17.07 43.13,17.07 42.82,16.76 42.82,16.15 UC2.3 | 43.59,17.07 43.59,24.69 UC2.21 | UC328DIP.22 19.81,20.83 v20.32,20.83
  Top 0.305: 19.51,7.62 19.56,7.67 19.56,10.61 20.78,11.43 JUSB.1 | C5.2 13.87,27.94 v13.97,28.04 | v13.97,25.4 v17.78,25.4
  Top 0.61: J4.1 J3.1
  Bottom 0.152: v17.78,25.4 UC328DIP.22 | v20.32,20.83 UC328DIP.8
  Bottom 0.305: v13.97,28.04 v13.97,25.4
  Bottom 0.508: 25.27,5.33 25.27,10.29 JUSB.1
  pour Bottom: -1.27,68.58 -1.27,-2.54 52.07,-2.54 53.34,-1.27 53.34,66.04 50.8,68.58
MISO  (via drill 0.35)
  Top 0.152: 5.18,45.72 6.4,46.94 9.45,46.94 10.06,46.33 10.06,45.41 10.97,44.5 11.89,44.5 12.65,43.74 12.65,42.82 13.56,41.91 14.48,41.91 15.24,41.15 15.24,40.23 16,39.47 16.92,39.47 17.68,38.71 17.68,37.8 18.59,36.88 42.37,36.88 43.13,36.12 43.13,35.2 44.04,34.29 44.96,34.29 45.72,33.53 45.72,32.61 46.48,31.85 47.85,31.85 48.16,31.55 48.16,23.32 UC2.16 | v19.96,31.7 18.59,31.7 17.68,32.61 17.68,33.53 16.92,34.29 16,34.29 15.24,35.05 15.24,35.97 14.33,36.88 13.41,36.88 12.65,37.64 12.65,38.56 11.73,39.47 10.82,39.47 10.06,40.23 10.06,41.15 9.3,41.91 8.38,41.91 5.18,45.11 5.18,45.72 | 5.18,45.72 J1.1
  Bottom 0.152: v19.96,31.7 22.1,31.7 22.86,30.94 22.86,28.96 27.89,23.93 27.89,22.86 UC328DIP.18
MOSI  (via drill 0.35)
  Top 0.152: v45.72,22.4 48.16,22.4 UC2.15 | UC328DIP.17 29.11,24.23 7.47,24.23 6.55,23.32 6.55,22.4 8.69,20.27 8.69,14.78 7.77,13.87 4.42,13.87 3.66,14.63 3.66,23.93 1.37,26.21 1.37,46.33 2.44,47.4 2.44,48.16 J1.4
  Bottom 0.152: v45.72,22.4 44.2,22.4 39.78,17.98 35.36,17.98 UC328DIP.17
N$1  (via drill 0.35)  (1 unrouted)
  Top 0.152: v21.08,10.16 21.21,10.03 25.27,10.03 JUSB.2 | 18.67,8 18.67,11.05 v19.05,11.43
  Bottom 0.152: JUSB.2 26.67,10.79 26.04,10.16 26.04,5.49 26.09,5.44 | v19.05,11.43 19.81,11.43 v21.08,10.16
N$2
  Top 0.152: JDATA.1 25.45,54.71 25.45,55.02 27.58,57.15 U$1.DATA
  Bottom 0.152: JPD.1 24.54,60.2 27.58,57.15 U$1.DATA
N$3
  Top 0.152: PORTC.3 39.78,28.35 39.78,23.32 UC2.25
N$4
  Top 0.152: JLATCH.1 29.26,54.71 29.26,55.32 31.09,57.15 U$1.LATCH
  Bottom 0.152: JPL.1 30.18,63.4 30.18,58.06 31.09,57.15 U$1.LATCH
N$5
  Top 0.152: JCLK.1 33.07,54.71 33.07,55.63 34.59,57.15 U$1.CLOCK
  Bottom 0.152: JPC.1 38.41,62.18 38.41,60.81 34.75,57.15 U$1.CLOCK
N$11
  Top 0.152: UC2.19 45.11,24.84 45.11,28.04 43.13,30.02 43.13,30.94 42.37,31.7 41.45,31.7 40.54,30.79 40.54,29.87 39.93,29.26 33.07,29.26 31.85,30.48 PORTC.7
N$12  (via drill 0.35)
  Top 0.152: v41.76,28.96 42.67,28.04 42.67,24.84 UC2.22 | v38.41,31.7 30.48,31.7 29.26,30.48 PORTC.8
  Bottom 0.152: v41.76,28.96 40.54,30.18 40.54,31.09 39.93,31.7 v38.41,31.7
RESET  (via drill 0.35)
  Top 0.152: v40.84,19.96 39.78,19.96 UC2.29 | v37.34,19.96 36.27,18.9 10.67,18.9 v9.3,20.27 | v2.44,24.23 1.37,23.16 1.37,16.31 2.44,15.24 UC328DIP.1
  Bottom 0.152: v37.34,19.96 v40.84,19.96 | v9.3,20.27 7.62,20.27 2.59,15.24 UC328DIP.1 | v2.44,24.23 3.5,25.3 3.5,31.55 4.72,32.77 4.72,39.47 3.81,40.39 3.81,48.77 5.03,49.99 5.03,50.75 J1.5
SCK  (via drill 0.35)
  Top 0.152: 22.86,30.94 23.62,31.7 24.54,31.7 25.3,32.46 25.3,33.38 26.21,34.29 42.37,34.29 43.13,33.53 43.13,32.61 43.89,31.85 44.81,31.85 45.72,30.94 45.72,29.41 46.63,28.5 46.63,24.84 UC2.17 | 22.86,30.94 22.86,30.02 21.18,28.35 v21.03,28.35 | v7.32,46.02 7.32,45.57 8.53,44.35 9.45,44.35 10.21,43.59 10.21,42.67 10.97,41.91 11.89,41.91 12.8,41 12.8,40.08 13.56,39.32 14.48,39.32 15.24,38.56 15.24,37.64 16.15,36.73 17.07,36.73 17.83,35.97 17.83,35.05 18.59,34.29 19.51,34.29 20.42,33.38 20.42,32.46 21.18,31.7 22.1,31.7 22.86,30.94
  Bottom 0.152: v21.03,28.35 21.03,27.13 25.3,22.86 UC328DIP.19 | v7.32,46.02 J1.3
USBD+
  Top 0.152: 17.68,8.84 17.68,11.38 18.95,12.65 27.13,12.65 28.35,11.43 JUSB.3 | 17.68,8.84 17.68,7.62 USB_MINI.D+ | 17.68,8.84 17.07,9.45 11.43,9.45 8.99,7.01 ZENER2.C
  Bottom 0.152: USB_MICRO.D+1 26.67,8.99 29.11,11.43 JUSB.3 | 5.18,7.62 5.18,10.06 R4.1 | 5.18,7.62 8.23,7.62 8.84,7.01 ZENER2.C | 5.18,7.62 R3.2
USBD-  (1 unrouted)
  Top 0.152: 5.18,4.42 5.18,5.03 R2.2 | 5.18,4.42 5.18,2.59 R1.1 | 17.22,4.42 17.22,5.49 17.07,5.64 17.07,7.47 USB_MINI.D- | 17.22,4.42 16.31,3.5 14.48,3.5 13.56,4.42 8.99,4.42 ZENER1.C 8.84,4.42 5.18,4.42 | JUSB.4 29.21,8.89 28.4,8.89 25.91,6.4 23.77,6.4 20.88,3.5 18.14,3.5 17.22,4.42
  Bottom 0.152: JUSB.4 27.3,6.99 27.3,5.38 27.38,5.31
VCC  (via drill 0.35)  (2 unrouted)
  Top 0.152: UC328DIP.21 UC328DIP.20 | 45.11,23.77 45.41,23.77 45.87,24.23 45.87,24.69 UC2.18 | 45.11,23.77 44.81,23.77 44.35,24.23 44.35,24.69 UC2.20 | 45.11,23.77 45.11,16.15 UC2.6 | 43.43,16.15 UC2.4 | USB_MINI.VBUS 16.15,7.62 15.85,7.62 14.33,9.14 12.19,9.14 9.91,6.86 9.91,6.71 9.3,6.1 4.72,6.1 3.5,4.88 3.5,3.5 R1.2 2.29,2.54 1.14,3.68 1.14,10.16 R4.2 | C5.1 2.59,28.04 2.59,31.7 C3.1 2.59,31.85 3.81,33.07 C4.+ 3.81,37.19 2.59,38.41 2.59,45.72 | U$1.VCC 37.34,57.15 32.16,51.97 10.82,51.97 10.06,51.21 10.06,50.29 9.3,49.53 8.08,49.53 5.49,46.94 3.81,46.94 2.59,45.72 | 2.59,45.72 J1.2 3.81,46.99 5.59,46.99 6.86,48.26 J9.1
  Top 0.305: 43.43,16.15 43.43,14.14 39.32,11.43 JUSB.5 | v45.11,14.94 45.11,16.15
  Top 0.508: v33.27,8.38 34.29,9.4 JUSB.5
  Top 0.61: J10.1 J9.1
  Bottom 0.152: UC328DIP.21 20.27,22.86 17.83,20.42 17.83,15.24 UC328DIP.7 17.68,15.24 17.68,12.19 15.7,10.21 9.6,10.21 8.69,11.12 3.5,11.12 R4.2 2.34,10.16 1.37,11.12 1.37,26.82 2.44,27.89 C5.1 | UC328DIP.20 22.86,21.79 29.41,15.24 29.41,14.78 31.24,12.95 32.77,12.95 JUSB.5
  Bottom 0.305: v45.11,14.94 42.57,12.39 38.05,12.39 37.08,11.43 JUSB.5
  Bottom 0.508: 28.07,5.24 28.07,6.43 31.11,8.38 v33.27,8.38
  Bottom 0.61: J9.1 J7.1

### Text on the board
Top: SNES2USB
Bottom: SNES2USB
tPlace: 1M | 12MHz | 68 | 1.5k | SNES2USB
tNames: Vcc | GND | 328 | 328 | GND | ID | D+ | D- | VCC
bNames: v1.0 - Feb2020 | http://electrogeek.cc/snes%20pad%20usb%20adapter.html | USB_Micro